# EAGLE design ESP32-velky stabilizator (EAGLE 9.6.2)
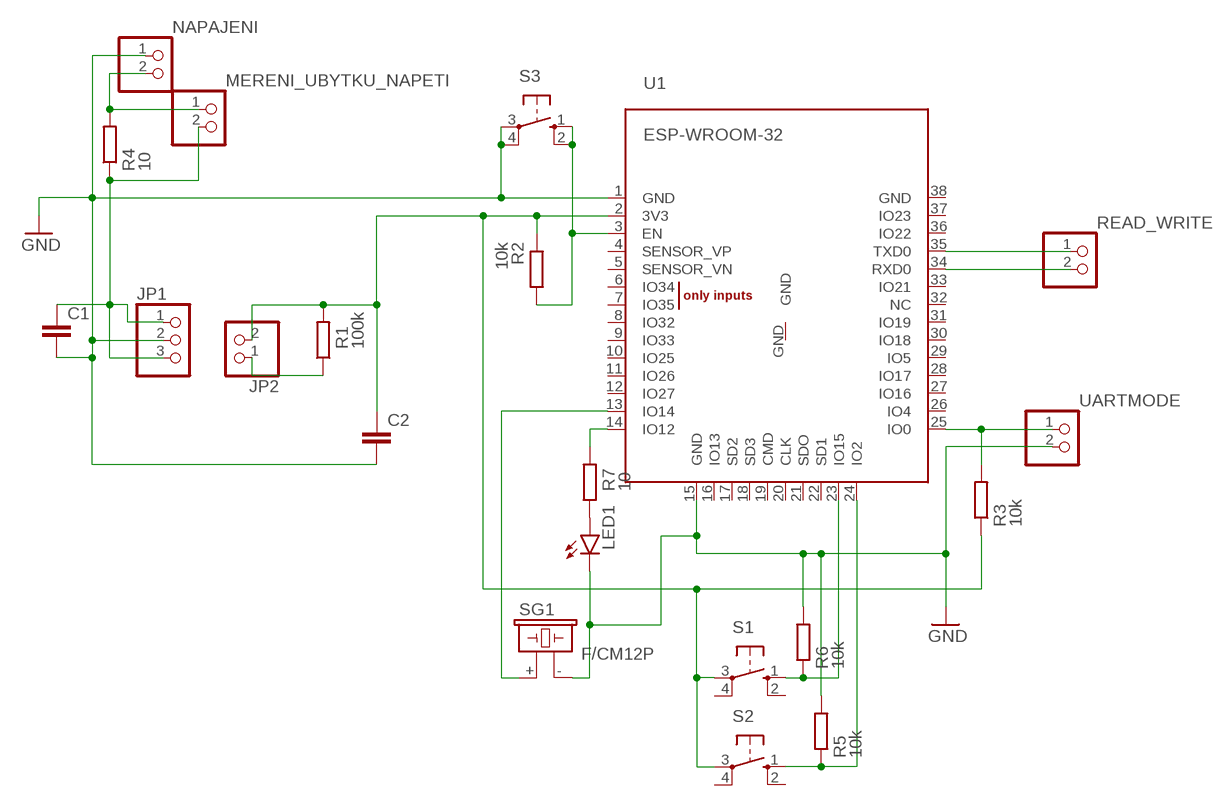
[diagram p0: schematic, sheet 1]

## Parts
C1  C2.5/2  [C2.5-2]
C2  C2.5/2  [C2.5-2]
JP1  PINHD-1X3  [1X03]
JP2  PINHD-1X2  [1X02]
LED1  LED5MM  [LED5MM]
MERENI_UBYTKU_NAPETI  PINHD-1X2  [1X02]
NAPAJENI  PINHD-1X2  [1X02]
R1  100k  R-EU_0207/10  [0207/10]
R2  10k  R-EU_0207/10  [0207/10]
R3  10k  R-EU_0207/10  [0207/10]
R4  10  R-EU_0207/10  [0207/10]
R5  10k  R-EU_0207/10  [0207/10]
R6  10k  R-EU_0207/10  [0207/10]
R7  10  R-EU_0207/10  [0207/10]
READ_WRITE  PINHD-1X2  [1X02]
S1  10-XX  [B3F-10XX]
S2  10-XX  [B3F-10XX]
S3  10-XX  [B3F-10XX]
SG1  F/CM12P  [F/CM12P]
U1  ESP-WROOM-32  [ESP-WROOM-32]
UARTMODE  PINHD-1X2  [1X02]

## Nets
GND: C1.2 C2.2 JP1.2 LED1.K(C) NAPAJENI.1 R5.2 R6.2 S3.3(P) S3.4(P1) SG1.- U1.1(GND) U1.15(GND) UARTMODE.2
N$1: C1.1 JP1.1 JP1.3 MERENI_UBYTKU_NAPETI.2 R4.1
N$2: C2.1 JP2.2 R1.2 R2.1 R3.1 S1.3(P) S2.3(P) U1.2(3V3)
N$4: JP2.1 R1.1
N$5: R2.2 S3.1(S) S3.2(S1) U1.3(EN)
N$6: READ_WRITE.2 U1.34(RXD0)
N$7: READ_WRITE.1 U1.35(TXD0)
N$8: R3.2 U1.25(IO0) UARTMODE.1
N$9: R7.2 U1.14(IO12)
N$10: MERENI_UBYTKU_NAPETI.1 NAPAJENI.2 R4.2
N$11: R5.1 S2.1(S) U1.24(IO2)
N$12: R6.1 S1.1(S) U1.23(IO15)
N$13: SG1.+ U1.13(IO14)
N$14: LED1.A R7.1
Unconnected: S1.2(S1) S1.4(P1) S2.2(S1) S2.4(P1) U1.4(SENSOR_VP) U1.5(SENSOR_VN) U1.6(IO34) U1.7(IO35) U1.8(IO32) U1.9(IO33) U1.10(IO25) U1.11(IO26) U1.12(IO27) U1.16(IO13) U1.17(SD2) U1.18(SD3) U1.19(CMD) U1.20(CLK) U1.21(SDO) U1.22(SD1) U1.26(IO4) U1.27(IO16) U1.28(IO17) U1.29(IO5) U1.30(IO18) U1.31(IO19) U1.32(NC) U1.33(IO21) U1.36(IO22) U1.37(IO23) U1.38(GND) U1.GND

## Library data of the parts
C1 C2 = capacitor-wima:C: CAPACITOR naming: grid - package width
JP1 = pinhead:PINHD-1X3: PIN HEADER
JP2 MERENI_UBYTKU_NAPETI NAPAJENI READ_WRITE UARTMODE = pinhead:PINHD-1X2: PIN HEADER
LED1 = led:LED: LED OSRAM: - CHIPLED LG R971, LG N971, LY N971, LG Q971, LY Q971, LO R971, LY R971 LH N974, LH R974 LS Q976, LO Q976, LY Q976 LO Q996 - Hyper CHIPLED LW Q18S LB Q993, LB Q99A, LB R99A - SideLED LS A670, LO A670, LY A670, LG A670, LP A670 LB A673, LV A673, LT A673, LW A673 LH A674 LY A675 LS A676, LA A676, LO A676, LY A676, LW A676 LS A679, LY A679, LG A679 - Hyper Micro SIDELED® LS Y876, LA Y876, LO Y876, LY Y876 LT Y87S - SmartLED LW L88C, LW L88S LB L89C, LB L89S, LG L890 LS L89K, LO L89K, LY L89K LS L896, LA L896, LO L896, LY L896 - TOPLED LS T670, LO T670, LY T670, LG T670, LP T670 LSG T670, LSP T670, LSY T670, LOP T670, LYG T670 LG T671, LOG T671, LSG T671 LB T673, LV T673, LT T673, LW T673 LH T674 LS T676, LA T676, LO T676, LY T676, LB T676, LH T676, LSB T676, LW T676 LB T67C, LV T67C, LT T67C, LS T67K, LO T67K, LY T67K, LW E67C LS E67B, LA E67B, LO E67B, LY E67B, LB E67C, LV E67C, LT E67C LW T67C LS T679, LY T679, LG T679 LS T770, LO T770, LY T770, LG T770, LP T770 LB T773, LV T773, LT T773, LW T773 LH T774 LS E675, LA E675, LY E675, LS T675 LS T776, LA T776, LO T776, LY T776, LB T776 LHGB T686 LT T68C, LB T68C - Hyper Mini TOPLED® LB M676 - Mini TOPLED Santana® LG M470 LS M47K, LO M47K, LY M47K Source: http://www.osram.convergy.de LUXEON: - LUMILED® LXK2-PW12-R00, LXK2-PW12-S00, LXK2-PW14-U00, LXK2-PW14-V00 LXK2-PM12-R00, LXK2-PM12-S00, LXK2-PM14-U00 LXK2-PE12-Q00, LXK2-PE12-R00, LXK2-PE12-S00, LXK2-PE14-T00, LXK2-PE14-U00 LXK2-PB12-K00, LXK2-PB12-L00, LXK2-PB12-M00, LXK2-PB14-N00, LXK2-PB14-P00, LXK2-PB14-Q00 LXK2-PR12-L00, LXK2-PR12-M00, LXK2-PR14-Q00, LXK2-PR14-R00 LXK2-PD12-Q00, LXK2-PD12-R00, LXK2-PD12-S00 LXK2-PH12-R00, LXK2-PH12-S00 LXK2-PL12-P00, LXK2-PL12-Q00, LXK2-PL12-R00 Source: www.luxeon.com KINGBRIGHT: KA-3528ASYC Source: www.kingbright.com
R1-R7 = rcl:R-EU_: RESISTOR, European symbol; SPICEPREFIX: R
S1-S3 = switch-omron:10-XX: OMRON SWITCH; MPN: B3F-1000; OC_FARNELL: 176432; OC_NEWARK: 36M3542
SG1 = buzzer:F/CM12P: BUZZER Source: Buerklin; OC_FARNELL: unknown; OC_NEWARK: unknown
U1 = ESP32:ESP-WROOM-32

## Board
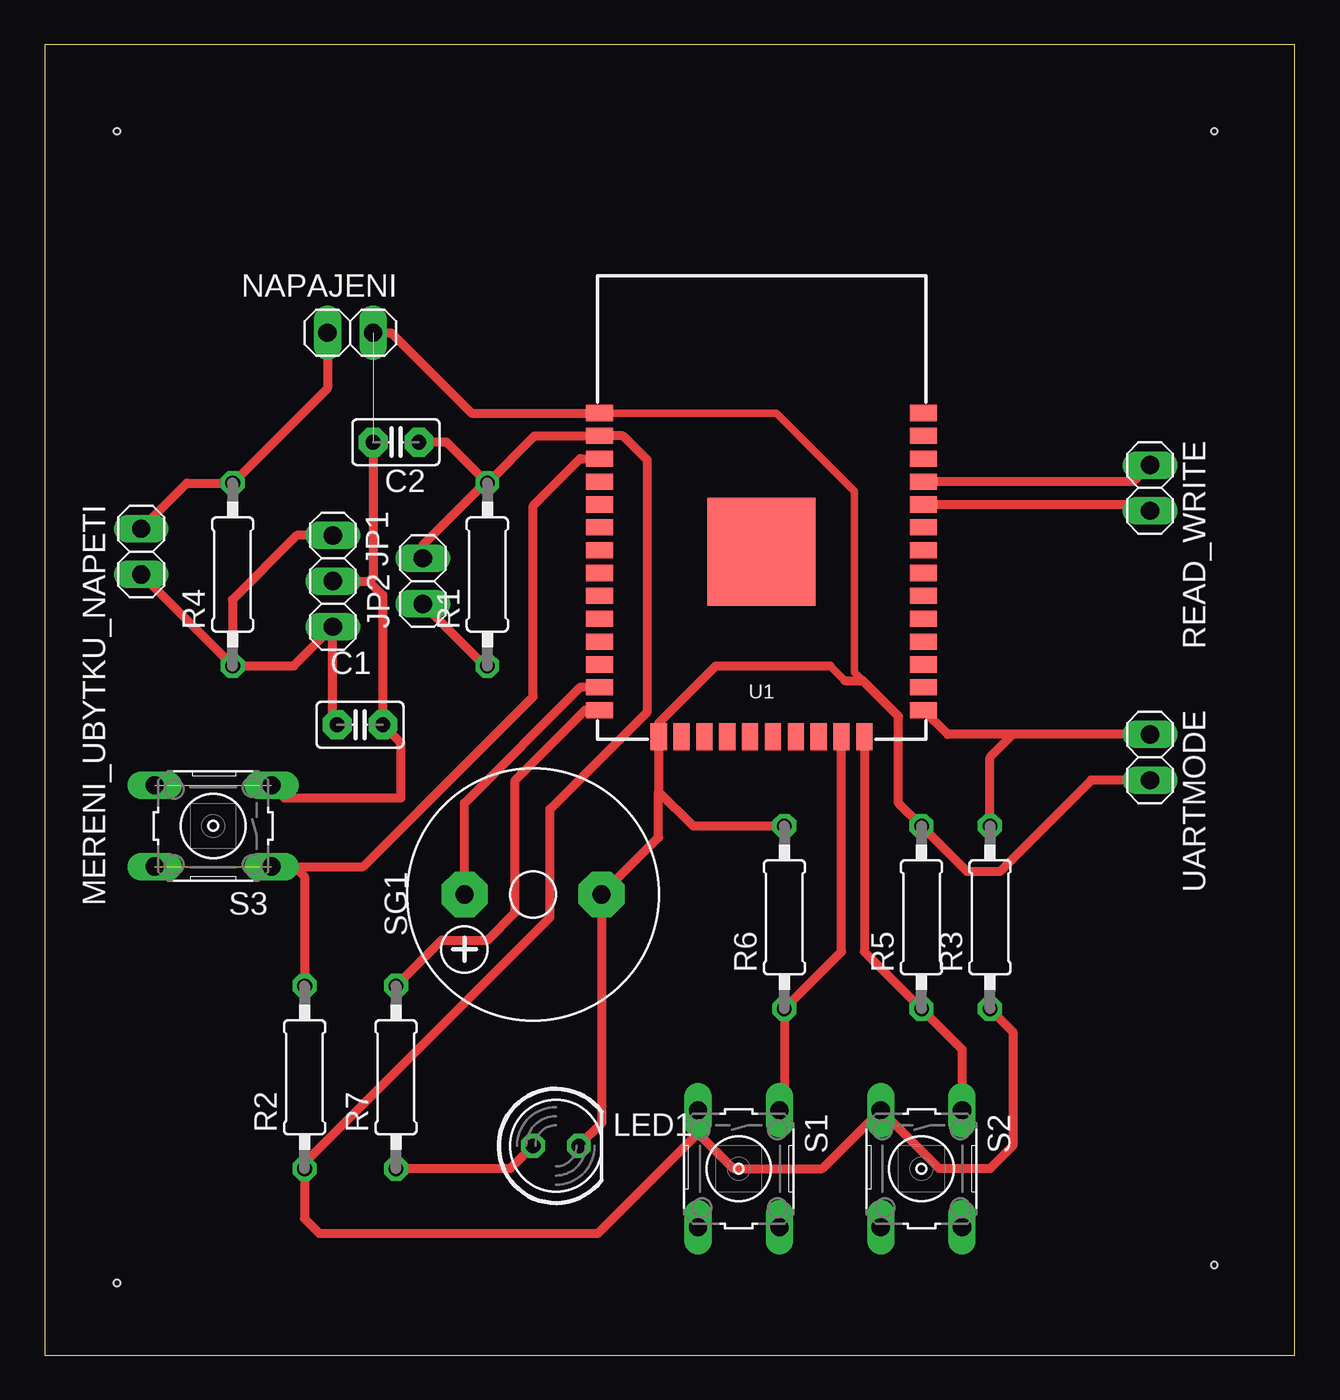
[diagram p1: board, top side]
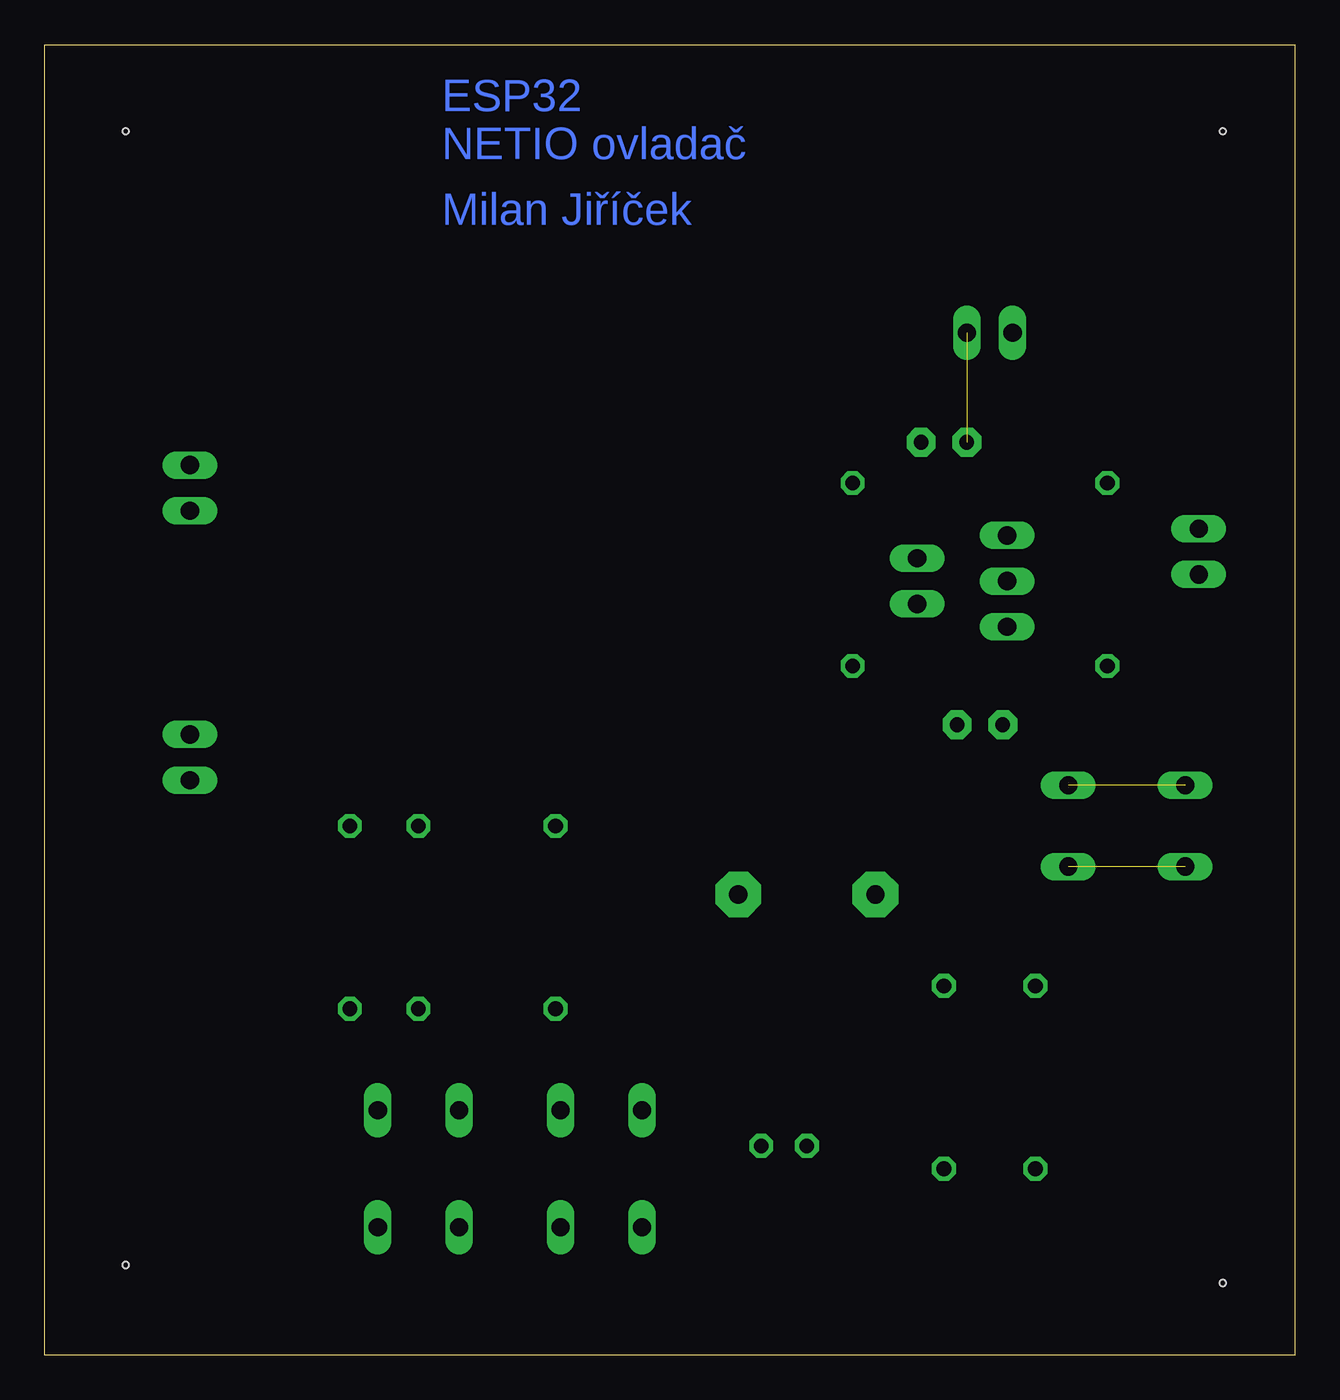
[diagram p2: board, bottom side, seen from below]

Size 69.48 x 72.79 mm. Coordinates in mm from the lower left corner, seen from the top.
Outline: 0,0 69.48,0 69.48,72.79 0,72.79 0,0
Copper layers (1*16): Top 0.035mm / dielectric 1.5mm / Bottom 0.035mm
Design rules "default": minimum track width 6mil, minimum drill 0.35mm, track to track 6mil, track to pad 6mil, pad to pad 6mil, via to via 6mil, smd to smd 6mil, copper to edge 40mil, drill to drill 6mil, minimum pad ring 10mil, minimum via ring 8mil, stop-mask expansion 4mil, vias tented up to drill 0mil, thermal gap 10mil
Holes 0.35 mm at 4,4 65,5 4,68 65,68

### Footprints (pad centres in the part's own frame; a part is rotated, then mirrored left to right if it is on the bottom)
C2.5-2 = drill 0.813 pad 1.6 octagon: 1 -1.27,0; 2 1.27,0
1X03 = drill 1.016 long: 1 -2.54,0; 2 0,0; 3 2.54,0
1X02 = drill 1.016 long: 1 -1.27,0; 2 1.27,0
LED5MM = drill 0.813 octagon: A -1.27,0; K 1.27,0
0207/10 = drill 0.813 octagon: 1 -5.08,0; 2 5.08,0
B3F-10XX = drill 1.016 long: 1 -3.251,2.261; 2 3.251,2.261; 3 -3.251,-2.261; 4 3.251,-2.261
F/CM12P = drill 1.016 pad 2.54 octagon: + 3.81,0; - -3.81,0
ESP-WROOM-32 = smd 0.9 x 1.5: 1 7.7,9; 2 6.43,9; 3 5.16,9; 4 3.89,9; 5 2.62,9; 6 1.35,9; 7 0.08,9; 8 -1.19,9; 9 -2.46,9; 10 -3.73,9; 11 -5,9; 12 -6.27,9; 13 -7.54,9; 14 -8.81,9; 25 -8.81,-9; 26 -7.54,-9; 27 -6.27,-9; 28 -5,-9; 29 -3.73,-9; 30 -2.46,-9; 31 -1.19,-9; 32 0.08,-9; 33 1.35,-9; 34 2.62,-9; 35 3.89,-9; 36 5.16,-9; 37 6.43,-9; 38 7.7,-9 | smd 1.5 x 0.9: 15 -10.3,5.715; 16 -10.3,4.445; 17 -10.3,3.175; 18 -10.3,1.905; 19 -10.3,0.635; 20 -10.3,-0.635; 21 -10.3,-1.905; 22 -10.3,-3.175; 23 -10.3,-4.445; 24 -10.3,-5.715 | smd 6 x 6: GND 0,0

### Placement (x,y rotation side)
C1  17.51,35.02 0 top
C2  19.51,50.72 180 top
JP1  16,43 270 top
JP2  21,43 90 top
LED1  28.4,11.62 0 top
MERENI_UBYTKU_NAPETI  5.35,44.64 270 top
NAPAJENI  16.97,56.8 180 top
R1  24.59,43.37 90 top
R2  14.43,15.43 90 top
R3  52.53,24.32 90 top
R4  10.43,43.37 90 top
R5  48.72,24.32 90 top
R6  41.1,24.32 90 top
R7  19.51,15.43 90 top
READ_WRITE  61.42,48.18 270 top
S1  38.56,10.35 270 top
S2  48.72,10.35 270 top
S3  9.35,29.4 180 top
SG1  27.13,25.59 180 top
U1  39.83,44.64 90 top
UARTMODE  61.42,33.21 270 top

### Tracks (layer width: path | path; a pad name or v marks a point on that pad's centre or on a via)
GND  (2 unrouted)
  Top 0.406: 43.64,38.29 44.47,37.47 | 46.47,36.47 45,37.93 45,48 40.66,52.34 U1.1
  Top 0.508: S3.3 13.32,30.94 19.78,30.94 19.78,34.02 C1.2 18.78,42.22 18,43 | NAPAJENI.1 19.24,56.8 23.7,52.34 U1.1 | UARTMODE.2 58.15,31.94 53.07,26.86 51.26,26.86 R5.2 47.45,30.67 47.45,35.48 46.47,36.47 45.47,37.47 44.47,37.47 | 34.12,31.3 U1.15 34.12,35.12 37.29,38.29 43.64,38.29 | 34.12,31.3 36.02,29.4 R6.2 | LED1.K 30.94,12.89 SG1.- 34.12,28.77 34.12,31.3 | JP1.2 18,43 | C2.2 18.24,43.24 18,43
N$1
  Top 0.508: R4.1 MERENI_UBYTKU_NAPETI.2 | R4.1 13.83,38.29 JP1.3 16,35.26 C1.1 | JP1.1 14,45.54 10.43,41.97 R4.1
N$2
  Top 0.508: 24.52,48.52 R1.2 27.21,51.07 U1.2 32.13,51.07 33.48,49.72 33.48,35.75 28.06,30.33 28.06,24.32 14.43,10.69 R2.1 14.43,7.57 15.26,6.74 30.71,6.74 36.3,12.33 | 24.52,48.52 22.32,50.72 C2.1 | S1.3 36.3,12.33 | 36.3,12.33 38.28,10.35 43.21,10.35 S2.3 49.71,10.35 52.53,10.35 53.8,11.62 53.8,17.97 R3.1 | JP2.2 21,45 24.52,48.52
N$4
  Top 0.508: JP2.1 24.44,38.29 R1.1
N$5  (1 unrouted)
  Top 0.508: R2.2 14.43,26.58 13.87,27.14 S3.1 17.68,27.14 27.13,36.59 27.13,47.18 29.75,49.8 U1.3
N$6
  Top 0.508: U1.34 61.07,47.26 READ_WRITE.2
N$7
  Top 0.508: READ_WRITE.1 60.5,48.53 U1.35
N$8
  Top 0.508: UARTMODE.1 53.8,34.48 | 53.8,34.48 50.18,34.48 U1.25 | R3.2 52.53,33.21 53.8,34.48
N$9
  Top 0.508: R7.2 22.05,23.05 24.59,23.05 26.13,24.59 26.13,31.94 30.02,35.83 U1.14
N$10
  Top 0.508: MERENI_UBYTKU_NAPETI.1 7.89,48.45 R4.2 15.7,53.72 NAPAJENI.2
N$11
  Top 0.508: U1.24 45.55,22.41 R5.1 50.98,16.98 S2.1
N$12
  Top 0.508: U1.23 44.27,22.41 R6.1 41.1,13.88 S1.1
N$13
  Top 0.508: SG1.+ 23.32,30.67 29.75,37.1 U1.13
N$14
  Top 0.508: LED1.A 25.86,10.35 R7.1

### Text on the board
Bottom: ESP32 / NETIO ovladač | Milan Jiříček